# Altium schematic sheet football_robot_main_board.SchDoc
size A4
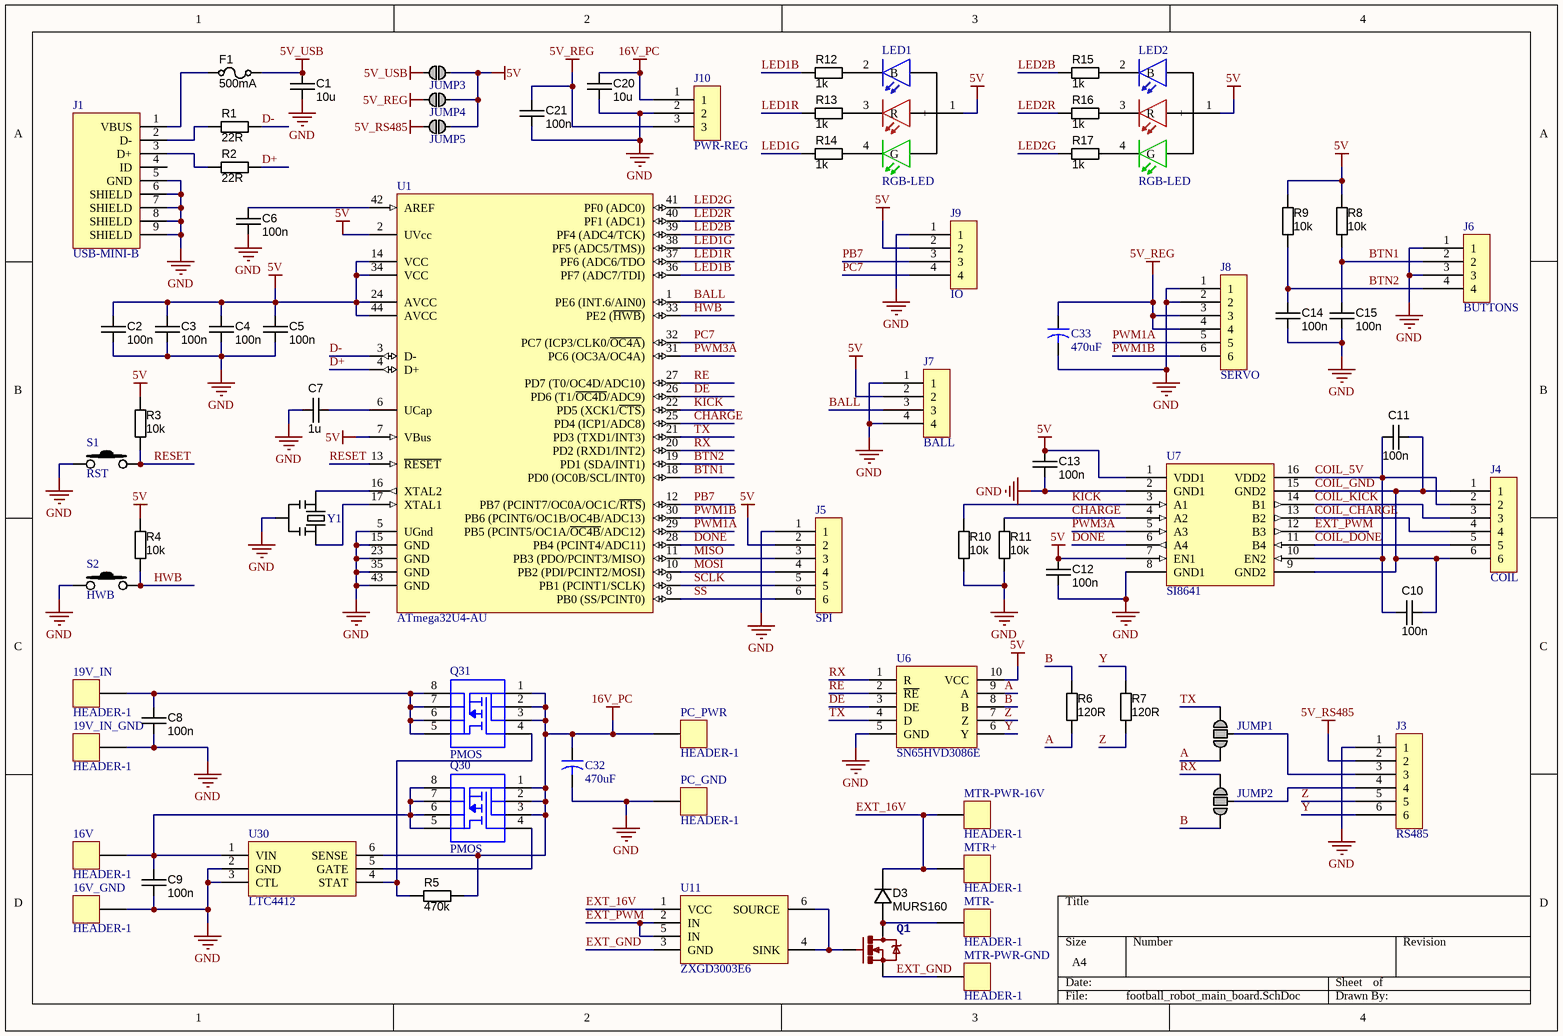
[diagram p0: football_robot_main_board.SchDoc]

## Parts
16V  HEADER-1  [POWER-VIA]
16V_GND  HEADER-1  [POWER-VIA]
19V_IN  HEADER-1  [POWER-VIA]
19V_IN_GND  HEADER-1  [POWER-VIA]
C1  10u  [CAPC3216X180N]
C2  100n  [CAPC1608X90N]
C3  100n  [CAPC1608X90N]
C4  100n  [CAPC1608X90N]
C5  100n  [CAPC1608X90N]
C6  100n  [CAPC1608X90N]
C7  1u  [CAPC1608X90N]
C8  100n  [CAPC1608X90N]
C9  100n  [CAPC1608X90N]
C10  100n  [CAPC1608X90N]
C11  100n  [CAPC1608X90N]
C12  100n  [CAPC1608X90N]
C13  100n  [CAPC1608X90N]
C14  100n  [CAPC1608X90N]
C15  100n  [CAPC1608X90N]
C20  10u  [CAPC3216X180N]
C21  100n  [CAPC1608X90N]
C32  470uF  [CAPR5-4X5]
C33  470uF  [CAPR5-4X5]
D3  MURS160  [DO-214AA]
F1  500mA  [RESC3216X70N]
J1  USB-MINI-B  [USB-B-MINI]
J3  RS485  [MICRO-MATCH-6]
J4  COIL  [MICRO-MATCH-6]
J5  SPI  [MICRO-MATCH-6]
J6  BUTTONS  [MICRO-MATCH-4]
J7  BALL  [MICRO-MATCH-4]
J8  SERVO  [MICRO-MATCH-6]
J9  IO  [MICRO-MATCH-4]
J10  PWR-REG  [PIN-HEADER-3]
JUMP1  JUMPER  [JUMPER-SMD-3WAY]  (value not drawn)
JUMP2  JUMPER  [JUMPER-SMD-3WAY]  (value not drawn)
JUMP3  JUMPER  [JUMPER-SMD-1010]  (value not drawn)
JUMP4  JUMPER  [JUMPER-SMD-1010]  (value not drawn)
JUMP5  JUMPER  [JUMPER-SMD-1010]  (value not drawn)
LED1  RGB-LED  [RGB-LED]
LED2  RGB-LED  [RGB-LED]
MTR+  HEADER-1  [POWER-VIA]
MTR-  HEADER-1  [POWER-VIA]
MTR-PWR-16V  HEADER-1  [POWER-VIA]
MTR-PWR-GND  HEADER-1  [POWER-VIA]
PC_GND  HEADER-1  [POWER-VIA]
PC_PWR  HEADER-1  [POWER-VIA]
Q1  MOSFET-N  [SOT669]  (value not drawn)
Q30  PMOS  [SO8]
Q31  PMOS  [SO8]
R1  22R  [RESC1608N_ZERO]
R2  22R  [RESC1608N_ZERO]
R3  10k  [RESC1608N_ZERO]
R4  10k  [RESC1608N_ZERO]
R5  470k  [RESC1608N_ZERO]
R6  120R  [RESC1608N_ZERO]
R7  120R  [RESC1608N_ZERO]
R8  10k  [RESC1608N_ZERO]
R9  10k  [RESC1608N_ZERO]
R10  10k  [RESC1608N_ZERO]
R11  10k  [RESC1608N_ZERO]
R12  1k  [RESC1608N_ZERO]
R13  1k  [RESC1608N_ZERO]
R14  1k  [RESC1608N_ZERO]
R15  1k  [RESC1608N_ZERO]
R16  1k  [RESC1608N_ZERO]
R17  1k  [RESC1608N_ZERO]
S1  RST  [DTSM-32S-B]
S2  HWB  [DTSM-32S-B]
U1  ATmega32U4-AU  [44ML_N]
U6  SN65HVD3086E  [SOP10]
U7  SI8641  [SOIC16]
U11  ZXGD3003E6  [SOT23-6-EEPROM]
U30  LTC4412  [TSOT-23-6]
Y1  Resonator  [PBRC16.00MR]  (value not drawn)

## Nets
5V: C2.2 C3.1 C4.1 C5.2 C12.2 C13.1 J5.2 J7.2 J9.2 JUMP3.2 JUMP4.2 JUMP5.2 LED1.1(+) LED2.1(+) R3.2 R4.2 R8.2 R9.2 U1.2(UVcc) U1.7(VBus) U1.14(VCC) U1.24(AVCC) U1.34(VCC) U1.44(AVCC) U6.10(VCC) U7.1(VDD1) U7.7(EN1)
5V_REG: C21.2 C33.1 J8.3 J8.4 J10.3 JUMP4.1
5V_RS485: J3.2 JUMP5.1
5V_USB: C1.2 F1.2 JUMP3.1
16V_PC: C20.2 C32.1 J10.1 PC_PWR.1 Q30.1 Q30.2 Q30.3 Q31.1 Q31.2 Q31.3 R5.1 U30.6(SENSE)
GND: 16V_GND.1 19V_IN_GND.1 C1.1 C2.1 C3.2 C4.2 C5.1 C6.1 C7.1 C8.2 C9.2 C12.1 C13.2 C14.2 C15.2 C20.1 C21.1 C32.2 C33.2 J1.5(GND) J1.6(SHIELD) J1.7(SHIELD) J1.8(SHIELD) J1.9(SHIELD) J3.1 J5.1 J6.1 J6.3 J7.1 J7.4 J8.1 J8.2 J9.1 J10.2 PC_GND.1 R10.1 R11.1 S1.1 S2.1 U1.5(UGnd) U1.15(GND) U1.23(GND) U1.35(GND) U1.43(GND) U6.5(GND) U7.2(GND1) U7.8(GND1) U30.2(GND) U30.3(CTL) Y1.2
A: JUMP1.3 R6.1 U6.9(A)
B: JUMP2.3 R6.2 U6.8(B)
BALL: J7.3 U1.1(PE6_(INT.6/AIN0))
BTN1: C15.1 J6.2 R8.1 U1.18(PD0_(OC0B/SCL/INT0))
BTN2: C14.1 J6.4 R9.1 U1.19(PD1_(SDA/INT1))
CHARGE: R11.2 U1.25(PD4_(ICP1/ADC8)) U7.4(A2)
COIL_5V: C10.1 C11.1 J4.2 U7.10(EN2) U7.16(VDD2)
COIL_CHARGE: J4.4 U7.13(B2)
COIL_DONE: J4.5 U7.11(B4)
COIL_GND: C10.2 C11.2 J4.1 J4.6 U7.9(GND2) U7.15(GND2)
COIL_KICK: J4.3 U7.14(B1)
D+: R2.2 U1.4(D+)
D-: R1.2 U1.3(D-)
DE: U1.26(PD6_(T1/~{OC4D}/ADC9)) U6.3(DE)
DONE: U1.28(PB4_(PCINT4/ADC11)) U7.6(A4)
EXT_16V: D3.K MTR+.1 MTR-PWR-16V.1 U11.1(VCC)
EXT_GND: MTR-PWR-GND.1 Q1.S U11.3(GND)
EXT_PWM: U7.12(B3) U11.2(IN) U11.5(IN)
HWB: R4.1 S2.2 U1.33(PE2_(~{HWB}))
KICK: R10.2 U1.22(PD5_(XCK1/~{CTS})) U7.3(A1)
LED1B: R12.2 U1.36(PF7_(ADC7/TDI))
LED1G: R14.2 U1.38(PF5_(ADC5/TMS)))
LED1R: R13.2 U1.37(PF6_(ADC6/TDO)
LED2B: R15.2 U1.39(PF4_(ADC4/TCK))
LED2G: R17.2 U1.41(PF0_(ADC0))
LED2R: R16.2 U1.40(PF1_(ADC1))
MISO: J5.3 U1.11(PB3_(PDO/PCINT3/MISO))
MOSI: J5.4 U1.10(PB2_(PDI/PCINT2/MOSI))
PB7: J9.3 U1.12(PB7_(PCINT7/OC0A/OC1C/~{RTS}))
PC7: J9.4 U1.32(PC7_(ICP3/CLK0/~{OC4A}))
PWM1A: J8.5 U1.29(PB5_(PCINT5/OC1A/~{OC4B}/ADC12))
PWM1B: J8.6 U1.30(PB6_(PCINT6/OC1B/OC4B/ADC13))
PWM3A: U1.31(PC6_(OC3A/OC4A)) U7.5(A3)
RE: U1.27(PD7_(T0/OC4D/ADC10)) U6.2(~{RE})
RESET: R3.1 S1.2 U1.13(~{RESET})
RX: JUMP2.1 U1.20(PD2_(RXD1/INT2)) U6.1(R)
SCLK: J5.5 U1.9(PB1_(PCINT1/SCLK))
SS: J5.6 U1.8(PB0_(SS/PCINT0))
TX: JUMP1.1 U1.21(PD3_(TXD1/INT3)) U6.4(D)
Y: J3.6 R7.2 U6.6(Y)
Z: J3.5 R7.1 U6.7(Z)
Net16V_1: 16V.1 C9.1 Q30.5 Q30.6 Q30.7 Q30.8 U30.1(VIN)
Net19V_IN_1: 19V_IN.1 C8.1 Q31.5 Q31.6 Q31.7 Q31.8
NetC6_2: C6.2 U1.42(AREF)
NetC7_2: C7.2 U1.6(UCap)
NetD3_A: D3.A MTR-.1 Q1.D
NetF1_1: F1.1 J1.1(VBUS)
NetJ1_2: J1.2(D-) R1.1
NetJ1_3: J1.3(D+) R2.1
NetJ3_3: J3.3 JUMP1.2
NetJ3_4: J3.4 JUMP2.2
NetLED1_2: LED1.2(B) R12.1
NetLED1_3: LED1.3(R) R13.1
NetLED1_4: LED1.4(G) R14.1
NetLED2_2: LED2.2(B) R15.1
NetLED2_3: LED2.3(R) R16.1
NetLED2_4: LED2.4(G) R17.1
NetQ1_G: Q1.G U11.4(SINK) U11.6(SOURCE)
NetQ30_4: Q30.4 U30.5(GATE)
NetQ31_4: Q31.4 R5.2 U30.4(STAT)
NetU1_16: U1.16(XTAL2) Y1.1
NetU1_17: U1.17(XTAL1) Y1.3

Not connected (* = marked no-connect by the designer): J1 4(ID)

## Library data of the parts
C1 C20 = CAPC_10u_1206_10V: Capacitor SMD Cer 10uF 10% 10V X5R 1206; Manufacturer 1: KEMET; Manufacturer Part Number 1: C1206C106K8PACTU; Ratings: 10V; X5R; Material: ceramic; Value: 10µ; SCDType: undef; Package / Case: 1206 (3216 metric); Tolerance: ±10%; Supplier 1: Digi-Key; Supplier Part Number 1: C1206C106K8PACTU-ND
C2-C15 C21 = CAPC_10n_0603_X7R_50V_10%: Capacitor SMD Cer 10nF 10% 50V X7R 0603; Manufacturer 1: TDK Corporation; Manufacturer Part Number 1: C1608X7R1H103K; Ratings: 50V; X7R; Material: ceramic; SCDType: spec; Value: 10n; Package / Case: 0603 (1608 metric); Tolerance: ±10%; Supplier 1: Digi-Key; Supplier Part Number 1: 445-1311-1-ND; ComponentLink1URL: http://product.tdk.com/capacitor/mlcc/en/documents/mlcc_commercial_general_en.pdf; ComponentLink1Description: http://product.tdk.com/capacitor/mlcc/en/documents/mlcc_commercial_general_en.pdf; Supplier 2: Digi-Key; Supplier Part Number 2: 478-1227-1-ND; Manufacturer 2: AVX Corporation; Manufacturer Part Number 2: 06035C103KAT2A; ComponentLink2URL: http://www.avx.com/docs/Catalogs/cx7r.pdf; ComponentLink2Description: http://www.avx.com/docs/Catalogs/cx7r.pdf
C32 C33 = Cap2: Capacitor; Value: 100pF; Published: 23-Sep-2002; PackageReference: CAPR5-4X5; Publisher: Altium Limited; PackageDescription: Capacitor; 2 Leads
D3 = DIODE_100V_1.5A_SMA: Diode SMD 100V 1.5A SMA; Manufacturer 1: Diodes Inc; Manufacturer Part Number 1: S2BA-13-F; Ratings: 100V; 1.5A; Material: Si; Diode Type: Standard; Value: Vf = 1.15V @ 1.5A (Max); SCDType: source; Package / Case: DO-214AC, SMA; Supplier 1: Digi-Key; Supplier Part Number 1: S2BA-FDICT-ND
F1 = FUSE_160mA_1206: Fuse 160mA 63VDC 1206 SMD; Manufacturer 1: Holly Fuse; Manufacturer Part Number 1: 12T-0160L; Ratings: 160mA; 63VDC; slow-blow; SCDType: spec; Package / Case: 1206 (3216 metric); Value: 160mA
J1 = USB-B-MINI
J3-J5 J8 = HEADER-6
J6 J7 J9 = HEADER-4
J10 = HEADER-3
JUMP1 JUMP2 = JUMPER-SMD-3WAY
JUMP3-JUMP5 = JUMPER-SMD
Q1 = MOSFET-N: PROD_ID: IC-08089
R1-R17 = RES_0R_0603: Resistor SMD chip 0.0 Ohm 0.1W 0603; Manufacturer 1: Vishay/Dale; Manufacturer Part Number 1: CRCW06030000Z0EA; Tolerance: ±5%; Ratings: 1/10W; SCDType: spec; Value: 0R; Package / Case: 0603 (1608metric); Supplier 1: Digi-Key; Supplier Part Number 1: 541-0.0GCT-ND; ComponentLink1URL: http://www.vishay.com/doc?20035; ComponentLink1Description: http://www.vishay.com/doc?20035; Supplier 2: Digi-Key; Supplier Part Number 2: P0.0GTR-ND; Manufacturer 2: Panasonic Electronic Components; Manufacturer Part Number 2: ERJ-3GEY0R00V; RoHS 2: RoHS Compliant; ComponentLink2URL: http://industrial.panasonic.com/www-cgi/jvcr13pz.cgi?E+PZ+3+AOA0001+ERJ3GEY0R00V+7+WW; ComponentLink2Description: http://industrial.panasonic.com/www-cgi/jvcr13pz.cgi?E+PZ+3+AOA0001+ERJ3GEY0R00V+7+WW; Supplier 3: Digi-Key; Supplier Part Number 3: 311-0.0LECT-ND; Manufacturer 3: Yageo; Manufacturer Part Number 3: AC0603JR-070RL; RoHS 3: RoHS Compliant; ComponentLink3URL: http://www.yageo.com/documents/recent/PYu-AC_51_RoHS_L_2.pdf; ComponentLink3Description: http://www.yageo.com/documents/recent/PYu-AC_51_RoHS_L_2.pdf
S1 S2 = SW-PB-OPEN
U1 = ATmega32U4-AU: 8-bit AVR Microcontroller, 2.7-5.5V, 32KB Flash, 2.5KB EEPROM, 1KB SRAM, USB Controller, 44-pin TQFP, Industrial Grade (-40°C to 85°C); Published: 1-Apr-2010; DatasheetVersion: revD, Jan-2009; PackageVersion: rev.G, Jul-2007; PackageReference: 44ML; Publisher: Altium Limited; PackageDescription: 44-Pin Plastic Thin Quad Flat Pack, 10 x 10 x 1.0 mm Body, 0.8 mm Pitch (TQFP); Supplier 1: Digi-Key; Supplier Part Number 1: ATMEGA32U4-AU-ND; Supplier 2: Farnell; Supplier Part Number 2: 1748525; Supplier 3: Mouser; Supplier Part Number 3: 556-ATMEGA32U4-AU; ComponentLink1Description: Manufacturer Link; ComponentLink1URL: http://www.atmel.com/products/avr/default.asp?; ComponentLink2Description: ATmega16U4/32U4 Datasheet; ComponentLink2URL: http://www.atmel.com/dyn/resources/prod_documents/doc7766.pdf; ComponentLink3Description: ATmega16U4 ATmega32U4 Summary; ComponentLink3URL: http://www.atmel.com/dyn/resources/prod_documents/7766S.pdf; ComponentLink4Description: Atmel.com Home; ComponentLink4URL: http://www.atmel.com
U11 = ZXGD3003E6: MOSFET driver
Y1 = PBRC16.00MR